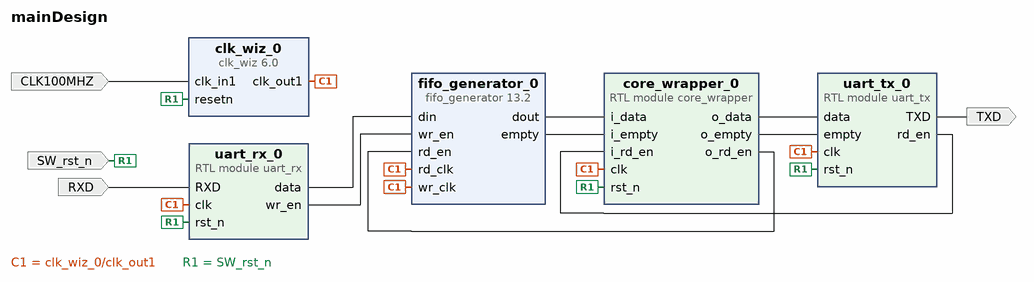
[diagram p0: block diagram of the top level]
# Vivado block design mainDesign, xc7a200tsbg484-1, Vivado 2024.1
create_bd_design mainDesign

create_bd_port -dir I -type clk CLK100MHZ
set_property -dict {CONFIG.ASSOCIATED_RESET RESET_N CONFIG.FREQ_HZ 100000000} [get_bd_ports CLK100MHZ]
create_bd_port -dir I -type rst SW_rst_n
set_property -dict {CONFIG.POLARITY ACTIVE_LOW} [get_bd_ports SW_rst_n]
create_bd_port -dir I RXD
create_bd_port -dir O TXD

create_bd_cell -type ip -vlnv xilinx.com:ip:fifo_generator:13.2 fifo_generator_0
set_property -dict [list \
  CONFIG.Fifo_Implementation Independent_Clocks_Block_RAM \
  CONFIG.Input_Data_Width 8 \
  CONFIG.Input_Depth 2048 \
  CONFIG.Output_Data_Width 8 \
  CONFIG.Reset_Pin false \
] [get_bd_cells fifo_generator_0]
create_bd_cell -type module -reference core_wrapper core_wrapper_0
create_bd_cell -type module -reference uart_tx uart_tx_0
create_bd_cell -type module -reference uart_rx uart_rx_0
create_bd_cell -type ip -vlnv xilinx.com:ip:clk_wiz:6.0 clk_wiz_0
set_property -dict [list \
  CONFIG.CLKOUT1_JITTER 151.636 \
  CONFIG.CLKOUT1_REQUESTED_OUT_FREQ 50 \
  CONFIG.MMCM_CLKOUT0_DIVIDE_F 20.000 \
  CONFIG.RESET_PORT resetn \
  CONFIG.RESET_TYPE ACTIVE_LOW \
] [get_bd_cells clk_wiz_0]

# ---- connections ----

connect_bd_net [get_bd_ports CLK100MHZ] [get_bd_pins clk_wiz_0/clk_in1]
connect_bd_net [get_bd_ports RXD] [get_bd_pins uart_rx_0/RXD]
connect_bd_net [get_bd_pins clk_wiz_0/clk_out1] \
  [get_bd_pins fifo_generator_0/wr_clk] [get_bd_pins fifo_generator_0/rd_clk] [get_bd_pins uart_rx_0/clk] \
  [get_bd_pins uart_tx_0/clk] [get_bd_pins core_wrapper_0/clk]
connect_bd_net [get_bd_pins core_wrapper_0/o_data] [get_bd_pins uart_tx_0/data]
connect_bd_net [get_bd_pins core_wrapper_0/o_empty] [get_bd_pins uart_tx_0/empty]
connect_bd_net [get_bd_pins core_wrapper_0/o_rd_en] [get_bd_pins fifo_generator_0/rd_en]
connect_bd_net [get_bd_pins fifo_generator_0/dout] [get_bd_pins core_wrapper_0/i_data]
connect_bd_net [get_bd_pins fifo_generator_0/empty] [get_bd_pins core_wrapper_0/i_empty]
connect_bd_net -net rst_n_1 [get_bd_ports SW_rst_n] \
  [get_bd_pins clk_wiz_0/resetn] [get_bd_pins uart_rx_0/rst_n] [get_bd_pins uart_tx_0/rst_n] \
  [get_bd_pins core_wrapper_0/rst_n]
connect_bd_net [get_bd_pins uart_rx_0/data] [get_bd_pins fifo_generator_0/din]
connect_bd_net [get_bd_pins uart_rx_0/wr_en] [get_bd_pins fifo_generator_0/wr_en]
connect_bd_net [get_bd_pins uart_tx_0/TXD] [get_bd_ports TXD]
connect_bd_net [get_bd_pins uart_tx_0/rd_en] [get_bd_pins core_wrapper_0/i_rd_en]

validate_bd_design
save_bd_design
